# Altium schematic sheet comparator.SchDoc
size A4; SheetNumber: 7; SheetTotal: 7
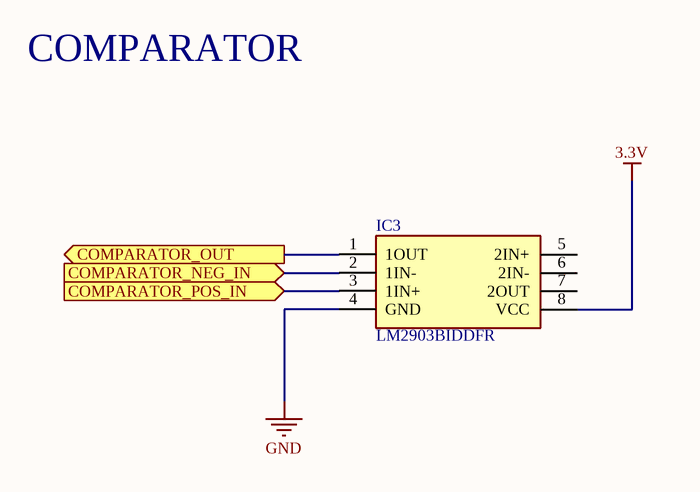
[diagram p0: comparator.SchDoc]

## Parts
IC3  LM2903BIDDFR  [SOT65P280X110-8N]

## Ports
COMPARATOR_NEG_IN (in), COMPARATOR_OUT (out), COMPARATOR_POS_IN (in)

## Nets
3.3V: IC3.8(VCC)
GND: IC3.4(GND)
COMPARATOR_NEG_IN: IC3.2(1IN-) ; port COMPARATOR_NEG_IN
COMPARATOR_OUT: IC3.1(1OUT) ; port COMPARATOR_OUT
COMPARATOR_POS_IN: IC3.3(1IN+) ; port COMPARATOR_POS_IN

Not connected (* = marked no-connect by the designer): IC3 5(2IN+) 6(2IN-) 7(2OUT)

## Notes on the sheet
- COMPARATOR

## Library data of the parts
IC3 = LM2903BIDDFR: Integrated Circuit; Manufacturer_Name: Texas Instruments; Datasheet Link: https://www.ti.com/lit/ds/symlink/lm2903b.pdf; Height: 1.1mm; Manufacturer_Part_Number: LM2903BIDDFR; Mouser Part Number: 595-LM2903BIDDFR; Mouser Price/Stock: https://www.mouser.co.uk/ProductDetail/Texas-Instruments/LM2903BIDDFR?qs=zW32dvEIR3tE88esuzsygA%3D%3D; Arrow Part Number: LM2903BIDDFR; Arrow Price/Stock: https://www.arrow.com/en/products/lm2903biddfr/texas-instruments